# Altium schematic sheet Power_SolenoidKill.SchDoc
size Letter; DocumentNumber: 4; SheetNumber: 4; SheetTotal: 4
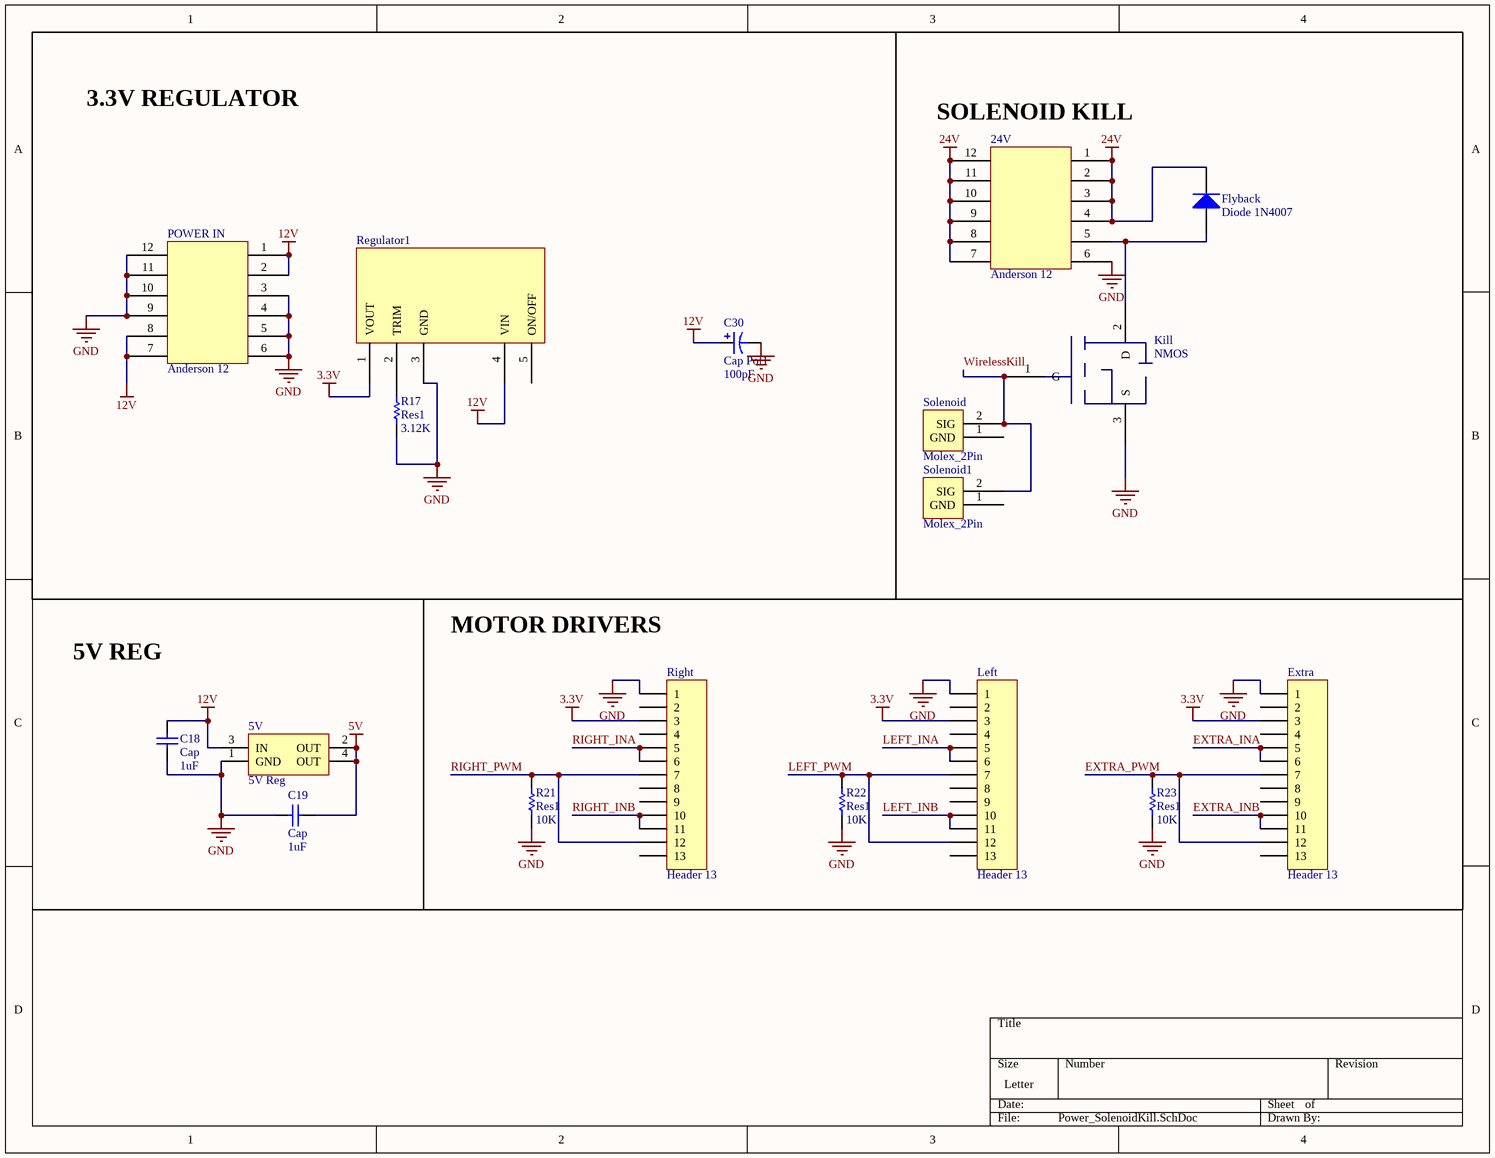
[diagram p0: Power_SolenoidKill.SchDoc]

## Parts
5V  5V Reg  [5V REG]
24V  Anderson 12  [PCBComponent_1 - duplicate2]
C18  Cap  value 1uF  [1608[0603]]
C19  Cap  value 1uF  [1608[0603]]
C30  Cap Pol1  value 100pF  [RB5-10.5]
Extra  Header 13  [HDR1X13]
Flyback  Diode 1N4007  [DO-41]
Kill  NMOS  [TO229P990X239-3N]
Left  Header 13  [HDR1X13]
POWER_IN  Anderson 12  [PCBComponent_1 - duplicate2]
R17  Res1  value 3.12K  [1608[0603]]
R21  Res1  value 10K  [1608[0603]]
R22  Res1  value 10K  [1608[0603]]
R23  Res1  value 10K  [1608[0603]]
Regulator1  Regulator  [PCBComponent_1]  (value not drawn)
Right  Header 13  [HDR1X13]
Solenoid  Molex_2Pin  [PCBComponent_1]
Solenoid1  Molex_2Pin  [PCBComponent_1]

## Blocks framed on the sheet
SOLENOID KILL: 24V Flyback Kill Solenoid Solenoid1

## Nets
3.3V: Extra.3 Left.3 Regulator1.1(VOUT) Right.3
5V: 5V.2(OUT) 5V.4(OUT) C19.1
12V: 5V.3(IN) C18.1 C30.1 POWER_IN.1 POWER_IN.2 POWER_IN.7 POWER_IN.8 Regulator1.4(VIN)
24V: 24V.1 24V.2 24V.3 24V.4 24V.7 24V.8 24V.9 24V.10 24V.11 24V.12 Flyback.2(K)
GND: 5V.1(GND) 24V.6 C18.2 C19.2 C30.2 Extra.1 Kill.3(S) Left.1 POWER_IN.3 POWER_IN.4 POWER_IN.5 POWER_IN.6 POWER_IN.9 POWER_IN.10 POWER_IN.11 POWER_IN.12 R17.1 R21.1 R22.1 R23.1 Regulator1.3(GND) Right.1
EXTRA_INA: Extra.5 Extra.6
EXTRA_INB: Extra.10 Extra.11
EXTRA_PWM: Extra.7 Extra.12 R23.2
LEFT_INA: Left.5 Left.6
LEFT_INB: Left.10 Left.11
LEFT_PWM: Left.7 Left.12 R22.2
RIGHT_INA: Right.5 Right.6
RIGHT_INB: Right.10 Right.11
RIGHT_PWM: R21.2 Right.7 Right.12
WirelessKill: Kill.1(G) Solenoid.2(SIG) Solenoid1.2(SIG)
Net24V_5: 24V.5 Flyback.1(A) Kill.2(D)
NetR17_2: R17.2 Regulator1.2(TRIM)

Not connected (* = marked no-connect by the designer): Extra 2 4 8 9 13; Left 2 4 8 9 13; Regulator1 5(ON/OFF); Right 2 4 8 9 13; Solenoid 1(GND); Solenoid1 1(GND)

## Notes on the sheet
- 3.3V REGULATOR
- MOTOR DRIVERS
- 5V REG

## Library data of the parts
5V = 5V Reg: 5V Linear Reg, 1.5A (Digi-Key: ADP3339AKCZ-5-R7CT-ND)
C18 C19 = Cap: Capacitor; Published: 8-Jun-2000; LatestRevisionDate: 17-Jul-2002; LatestRevisionNote: Re-released for DXP Platform.; PackageReference: RAD-0.3; Publisher: Altium Limited; PackageDescription: Radial Cap, Thru-Hole; 2 Leads; 0.3 in Pin Spacing
C30 = Cap Pol1: Polarized Capacitor (Radial); Published: 8-Jun-2000; LatestRevisionDate: 17-Jul-2002; LatestRevisionNote: Re-released for DXP Platform.; PackageReference: RB7.6-15; Publisher: Altium Limited; PackageDescription: Polarized Capacitor (Radial); 2 Leads
Extra Left Right = Header 13: Header, 13-Pin; LatestRevisionDate: 17-Jul-2002; LatestRevisionNote: Re-released for DXP Platform.; Publisher: Altium Limited
Flyback = Diode 1N4007: 1 Amp General Purpose Rectifier; Published: 8-Jun-2000; LatestRevisionDate: 17-Jul-2002; LatestRevisionNote: Re-released for DXP Platform.; DatasheetVersion: 1998; PackageVersion: Aug-1999; PackageReference: DO-41; Publisher: Altium Limited; PackageDescription: Diode, Axial; Body 5.2 x 2.7 mm (LxDia. max), Lead Dia. 0.86 mm (max); Code_JEDEC: DO-204-AL; ComponentLink1Description: Manufacturer Link; ComponentLink1URL: http://www.fairchildsemi.com/; ComponentLink2Description: Datasheet; ComponentLink2URL: http://www.fairchildsemi.com/ds/1N%2F1N4001.pdf
R17 R21-R23 = Res1: Resistor; Published: 8-Jun-2000; LatestRevisionDate: 17-Jul-2002; LatestRevisionNote: Re-released for DXP Platform.; PackageReference: AXIAL-0.3; Publisher: Altium Limited; PackageDescription: Axial Device, Thru-Hole; 2 Leads; 0.3 in Pin Spacing